# EAGLE design 3DM (EAGLE 6.6.0)
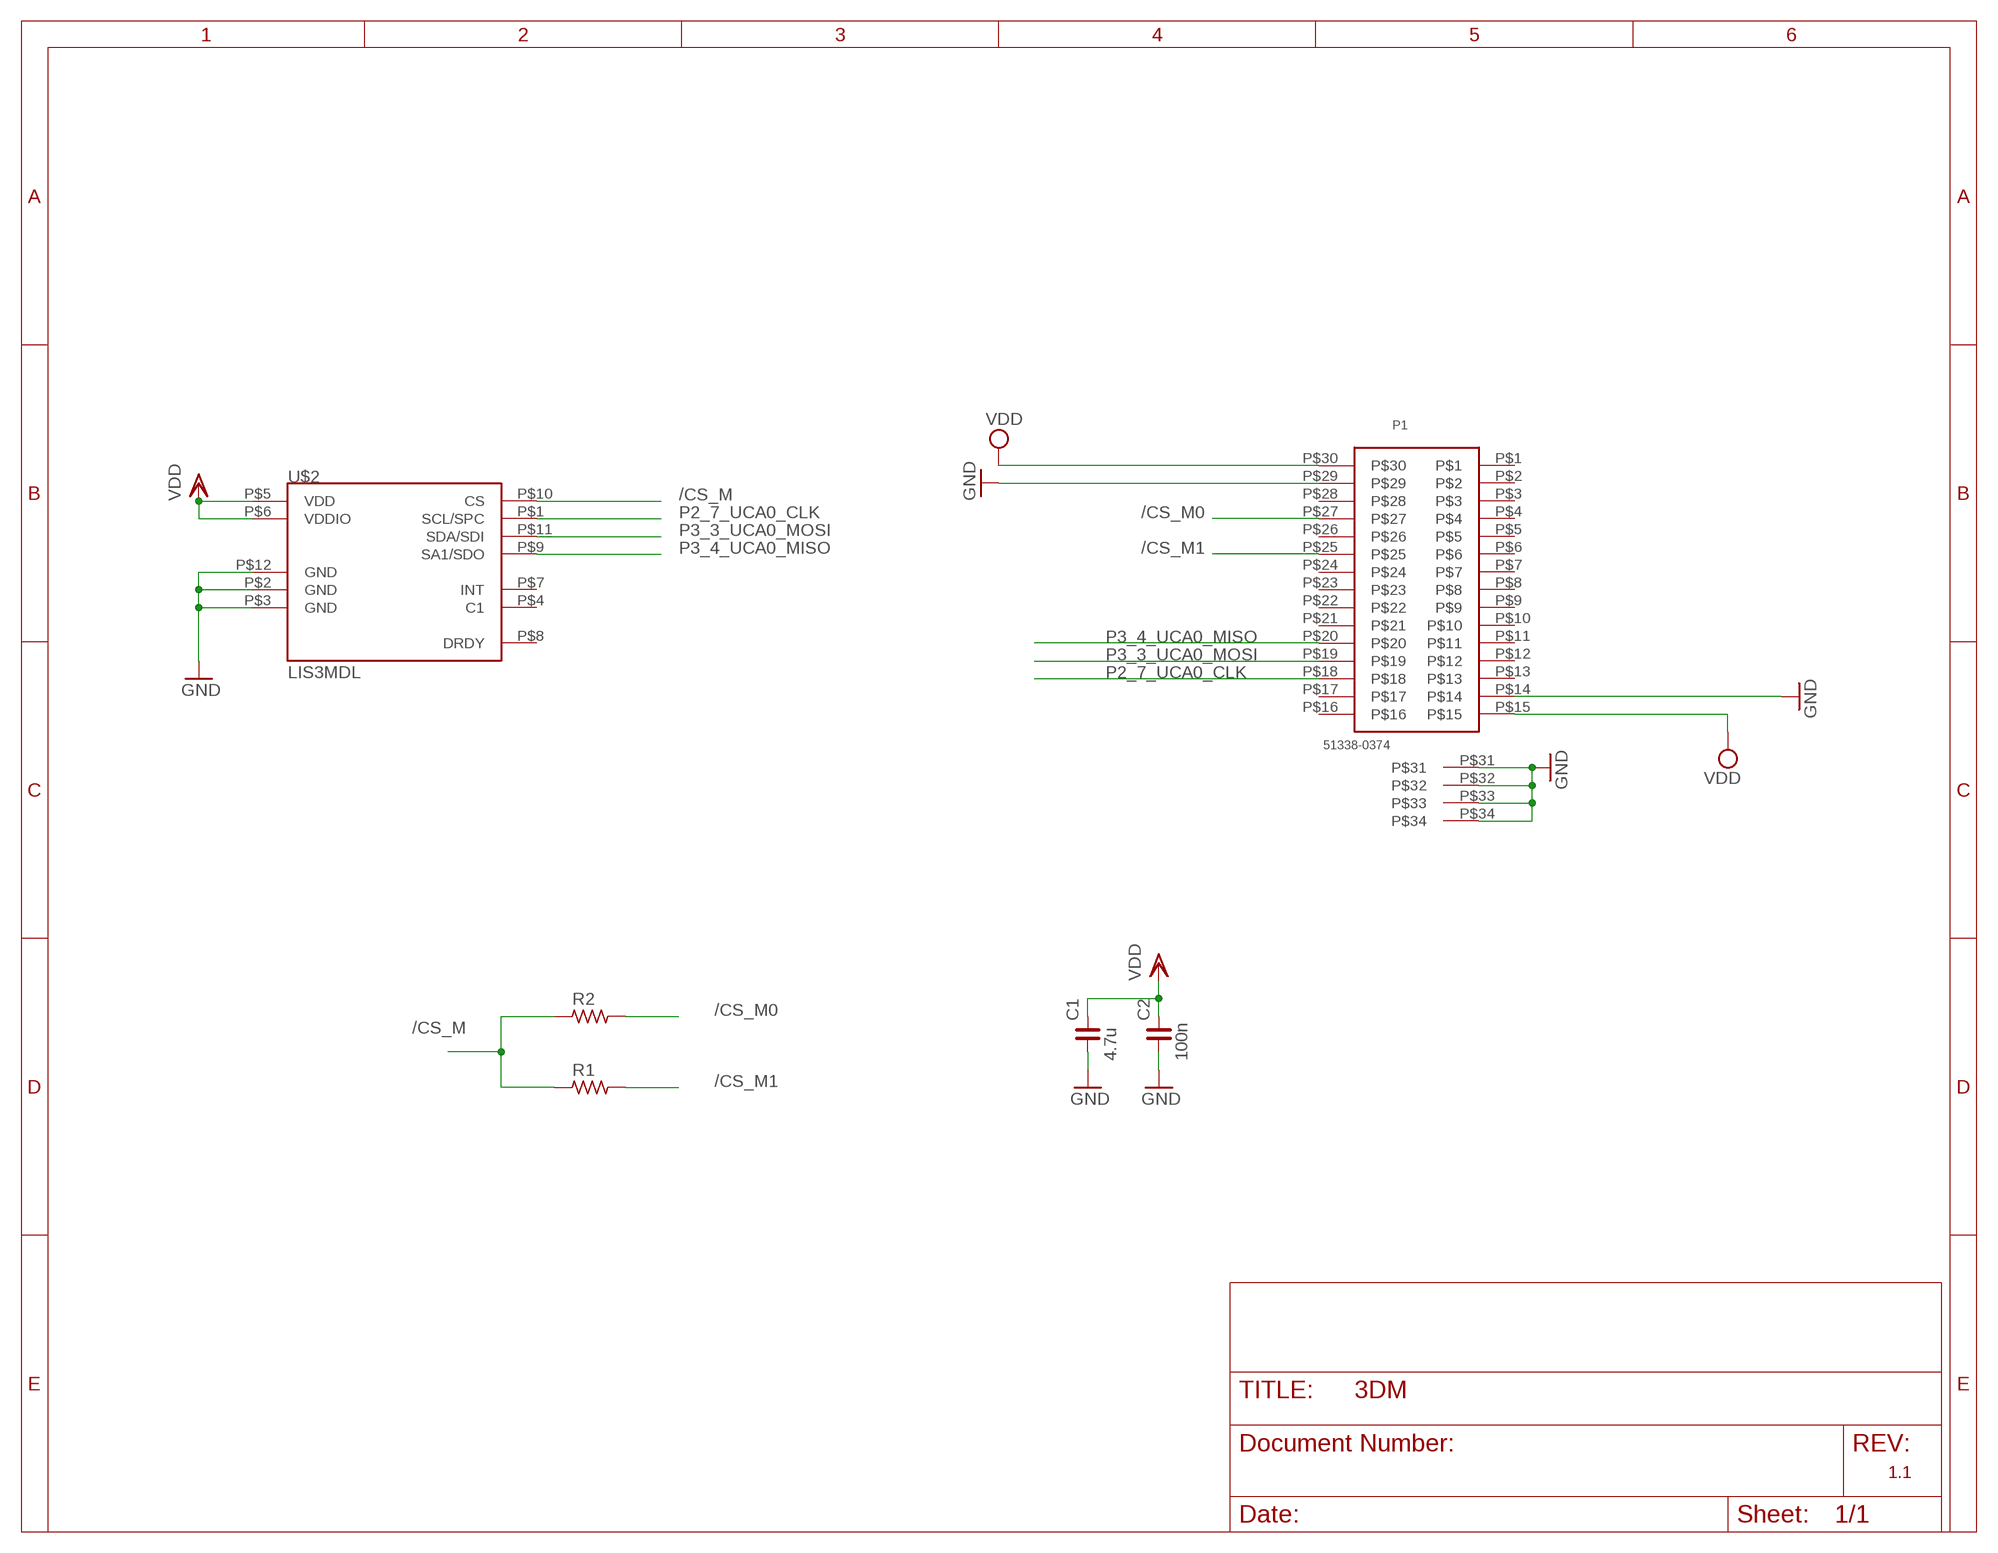
[diagram p0: schematic, sheet 1]

## Parts
C1  4.7u  C_0402  [C0402]
C2  100n  C_0402  [C0402]
P1  51338-0374  51338-0374_RECEPTACLE  [51338-0374_RECEPTACLE]
R1  R_0402  [R0402]
R2  R_0402  [R0402]
U$2  LIS3MDL  [VFLGA-2X2X1]

## Nets
/CS_M: R1.1 R2.1 U$2.P$10(CS)
/CS_M0: P1.P$27 R2.2
/CS_M1: P1.P$25 R1.2
GND: C1.1 C2.1 P1.P$14 P1.P$29 P1.P$31 P1.P$32 P1.P$33 P1.P$34 U$2.P$2(GND) U$2.P$3(GND) U$2.P$12(GND)
P2_7_UCA0_CLK: P1.P$18 U$2.P$1(SCL/SPC)
P3_3_UCA0_MOSI: P1.P$19 U$2.P$11(SDA/SDI)
P3_4_UCA0_MISO: P1.P$20 U$2.P$9(SA1/SDO)
VDD: C1.2 C2.2 P1.P$15 P1.P$30 U$2.P$5(VDD) U$2.P$6(VDDIO)
Unconnected: P1.P$1 P1.P$2 P1.P$3 P1.P$4 P1.P$5 P1.P$6 P1.P$7 P1.P$8 P1.P$9 P1.P$10 P1.P$11 P1.P$12 P1.P$13 P1.P$16 P1.P$17 P1.P$21 P1.P$22 P1.P$23 P1.P$24 P1.P$26 P1.P$28 U$2.P$4(C1) U$2.P$7(INT) U$2.P$8(DRDY)

## Notes on the sheet
- 1.1

## Library data of the parts
C1 C2 = rc-master-smd:C_: NON-POLARIZED CAP
P1 = Molex_SlimStack:51338-0374_RECEPTACLE
R1 R2 = rc-master-smd:R_: RESISTOR
U$2 = SparkFun-Sensors:LIS3MDL

## Board
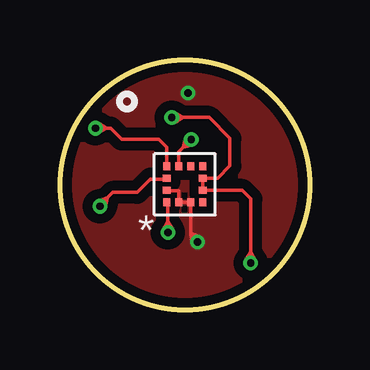
[diagram p1: board, top side]
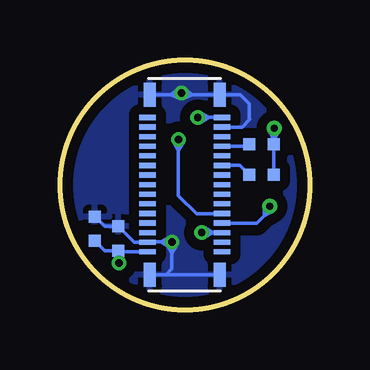
[diagram p2: board, bottom side, seen from below]

Size 10.4 x 10.4 mm. Coordinates in mm from the lower left corner, seen from the top.
Outline: circle at 5.2,5.2 radius 5.2
Copper layers (1*16): Top 0.035mm / dielectric 1.5mm / Bottom 0.035mm
Design rules "DIRTY_PCB": minimum track width 5mil, minimum drill 12mil, track to track 5mil, track to pad 5mil, pad to pad 5mil, via to via 5mil, smd to smd 0mil, copper to edge 10mil, drill to drill 10mil, minimum pad ring 10mil, minimum via ring 6mil, stop-mask expansion 2mil, vias tented up to drill 25mil, thermal gap 10mil

### Footprints (pad centres in the part's own frame; a part is rotated, then mirrored left to right if it is on the bottom)
C0402 = smd 0.5 x 0.5: 1 -0.508,0; 2 0.508,0
51338-0374_RECEPTACLE = smd 0.7 x 0.22: P$1 -1.55,2.8; P$2 -1.55,2.4; P$3 -1.55,2; P$4 -1.55,1.6; P$5 -1.55,1.2; P$6 -1.55,0.8; P$7 -1.55,0.4; P$8 -1.55,0; P$9 -1.55,-0.4; P$10 -1.55,-0.8; P$11 -1.55,-1.2; P$12 -1.55,-1.6; P$13 -1.55,-2; P$14 -1.55,-2.4; P$15 -1.55,-2.8; P$16 1.55,-2.8; P$17 1.55,-2.4; P$18 1.55,-2; P$19 1.55,-1.6; P$20 1.55,-1.2; P$21 1.55,-0.8; P$22 1.55,-0.4; P$23 1.55,0; P$24 1.55,0.4; P$25 1.55,0.8; P$26 1.55,1.2; P$27 1.55,1.6; P$28 1.55,2; P$29 1.55,2.4; P$30 1.55,2.8 | smd 0.5 x 1: P$31 1.45,3.75; P$32 -1.45,3.75; P$33 -1.45,-3.75; P$34 1.45,-3.75
R0402 = smd 0.5 x 0.5: 1 -0.508,0; 2 0.508,0
VFLGA-2X2X1 = smd 0.325 x 0.3: P$1 -0.75,0.75; P$2 -0.75,0.25; P$3 -0.75,-0.25; P$4 -0.75,-0.75; P$7 0.75,-0.75; P$8 0.75,-0.25; P$9 0.75,0.25; P$10 0.75,0.75 | smd 0.3 x 0.325: P$5 -0.25,-0.75; P$6 0.25,-0.75; P$11 0.25,0.75; P$12 -0.25,0.75

### Placement (x,y rotation side)
C1  8.95,3.37 270 bottom
C2  7.97,2.96 270 bottom
P1  5.2,5.21 0 bottom
R1  2.01,5.62 180 bottom
R2  2.01,6.89 180 bottom
U$2  5.2,5.22 90 top

### Tracks (layer width: path | path; a pad name or v marks a point on that pad's centre or on a via)
/CS_M  (via drill 0.3)
  Top 0.152: U$2.P$10 4.45,6.77 4.12,7.1 2.56,7.1 2.11,7.56 1.93,7.56 | 1.93,7.56 v1.47,7.56 | 1.93,7.56 1.59,7.76 v1.47,7.56 | 1.93,7.56 1.59,7.36 v1.47,7.56
  Bottom 0.152: R1.1 1.5,6.2 R2.1 1.47,6.92 1.47,7.1 | 1.47,7.1 v1.47,7.56 | 1.47,7.1 1.67,7.44 v1.47,7.56 | 1.47,7.1 1.28,7.44 v1.47,7.56
/CS_M0
  Bottom 0.152: R2.2 2.6,6.81 P1.P$27
/CS_M1
  Bottom 0.152: R1.2 2.91,6.01 P1.P$25
GND  (via drill 0.3)
  Top 0.152: U$2.P$12 4.45,4.96 4.95,4.96 U$2.P$2 U$2.P$3 5.45,3.18 | 5.45,3.18 5.45,3.1 v5.73,2.82 | 5.45,3.18 5.51,2.79 v5.73,2.82 | 5.45,3.18 5.82,3.03 v5.73,2.82
  Bottom 0.152: v5.73,2.82 6.19,2.82 | 6.19,2.82 P1.P$14 7.31,2.81 C2.1 8.54,3.47 C1.1 | 5.73,2.36 5.73,1.7 5.98,1.46 P1.P$33 P1.P$34 | 5.73,2.36 v5.73,2.82 | P1.P$29 2.81,7.61 2.49,7.92 2.51,7.94 2.51,8.58 2.89,8.96 P1.P$31 4.88,8.96 | 4.88,8.96 5.27,8.96 | 5.27,8.96 v5.34,9.02 | P1.P$32 5.79,8.96 | 5.79,8.96 5.27,8.96 | 6.19,2.82 5.85,3.02 v5.73,2.82 | 6.19,2.82 5.85,2.62 v5.73,2.82 | 5.73,2.36 5.93,2.71 v5.73,2.82 | 5.73,2.36 5.54,2.71 v5.73,2.82 | 4.88,8.96 5.25,8.81 v5.34,9.02 | 4.88,8.96 5.2,9.2 v5.34,9.02 | 5.79,8.96 5.48,9.2 v5.34,9.02 | 5.79,8.96 5.42,8.81 v5.34,9.02
  pour Top (isolate 0.4): 0.2,5.2 arc-90 5.2,10.2 arc-90 10.2,5.2 arc-90 5.2,0.2 arc-91
  pour Bottom (isolate 0.432): 0.2,5.2 arc-90 5.2,10.2 arc-90 10.2,5.2 arc-90 5.2,0.2 arc-91
P2_7_UCA0_CLK  (via drill 0.3)
  Top 0.152: v4.5,3.21 4.5,3.67 | 4.5,3.67 4.5,4.47 U$2.P$1 | 4.5,3.67 4.3,3.33 v4.5,3.21 | 4.5,3.67 4.69,3.33 v4.5,3.21
  Bottom 0.152: P1.P$18 4.04,3.21 | 4.04,3.21 v4.5,3.21 | 4.04,3.21 4.38,3.01 v4.5,3.21 | 4.04,3.21 4.38,3.41 v4.5,3.21
P3_3_UCA0_MOSI  (via drill 0.3)
  Top 0.152: U$2.P$11 4.42,5.44 3.77,5.44 3.21,4.88 2.19,4.88 1.96,4.65 | 1.96,4.65 1.66,4.35 v1.66,4.31 | 1.96,4.65 1.59,4.52 v1.66,4.31 | 1.96,4.65 1.89,4.26 v1.66,4.31
  Bottom 0.152: 3.33,3.61 P1.P$19 2.2,3.61 1.9,3.91 | 1.9,3.91 1.66,4.15 v1.66,4.31 | 1.9,3.91 1.89,4.31 v1.66,4.31 | 1.9,3.91 1.55,4.11 v1.66,4.31
P3_4_UCA0_MISO  (via drill 0.3)
  Top 0.152: U$2.P$9 4.95,6.58 5.14,6.77 | 5.14,6.77 v5.47,7.09 | 5.14,6.77 5.53,6.87 v5.47,7.09 | 5.14,6.77 5.25,7.15 v5.47,7.09
  Bottom 0.152: P1.P$20 3.67,3.99 4.71,3.99 5.47,4.75 5.47,6.63 | 5.47,6.63 v5.47,7.09 | 5.47,6.63 5.67,6.98 v5.47,7.09 | 5.47,6.63 5.27,6.98 v5.47,7.09
VDD  (via drill 0.3)
  Top 0.152: 5.12,8.01 6.21,8.01 7.08,7.13 7.08,5.99 6.56,5.47 U$2.P$6 U$2.P$5 7.6,4.97 7.95,4.62 7.95,2.4 | 5.12,8.01 v4.66,8.01 | v7.95,1.94 7.95,1.95 7.95,2.4 | 5.12,8.01 4.77,8.21 v4.66,8.01 | 5.12,8.01 4.77,7.81 v4.66,8.01 | 7.95,2.4 7.75,2.06 v7.95,1.94 | 7.95,2.4 8.14,2.05 v7.95,1.94
  Bottom 0.152: C1.2 8.54,2.45 C2.2 7.92,2.41 P1.P$15 7.94,2.41 7.95,2.4 | v4.66,8.01 4.2,8.01 | 4.2,8.01 P1.P$30 | 7.95,2.4 v7.95,1.94 | 4.2,8.01 4.54,7.81 v4.66,8.01 | 4.2,8.01 4.54,8.21 v4.66,8.01 | 7.95,2.4 7.75,2.05 v7.95,1.94 | 7.95,2.4 8.14,2.05 v7.95,1.94